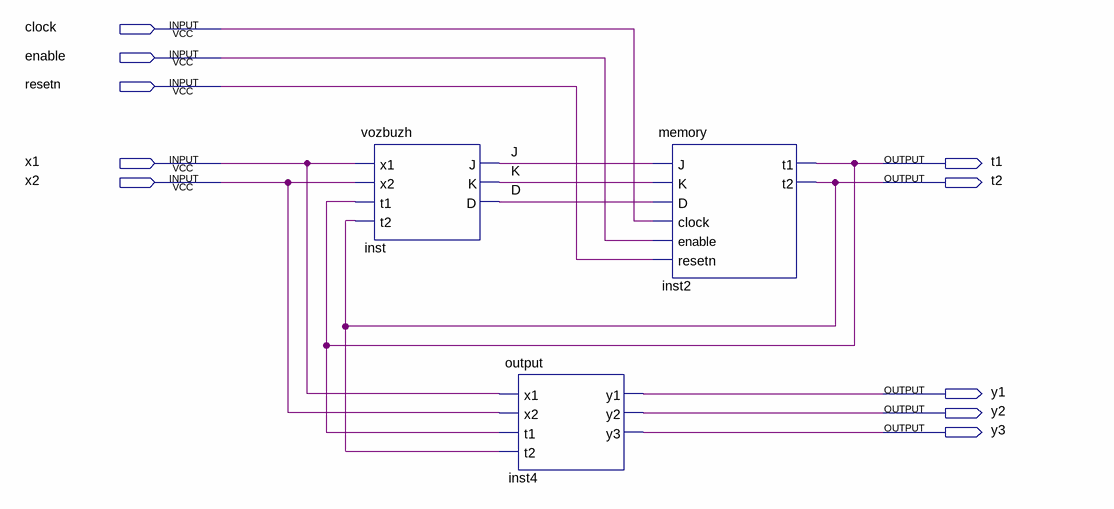
[diagram p0: schematic sheet]
// Quartus schematic mealy_decompose.bdf as structural Verilog: 3 symbols, 10 pins
module mealy_decompose (
  input  clock,
  input  enable,
  input  resetn,
  input  x1,
  input  x2,
  output t1,
  output t2,
  output y1,
  output y2,
  output y3
);

  wire D, J, K;

  vozbuzh inst (.x1(x1), .x2(x2), .t1(t1), .t2(t2), .J(J), .K(K), .D(D));
  \output  inst4 (.x1(x1), .x2(x2), .t1(t1), .t2(t2), .y1(y1), .y2(y2), .y3(y3));
  memory inst2 (.J(J), .K(K), .D(D), .clock(clock), .enable(enable), .resetn(resetn), .t1(t1), .t2(t2));
endmodule
